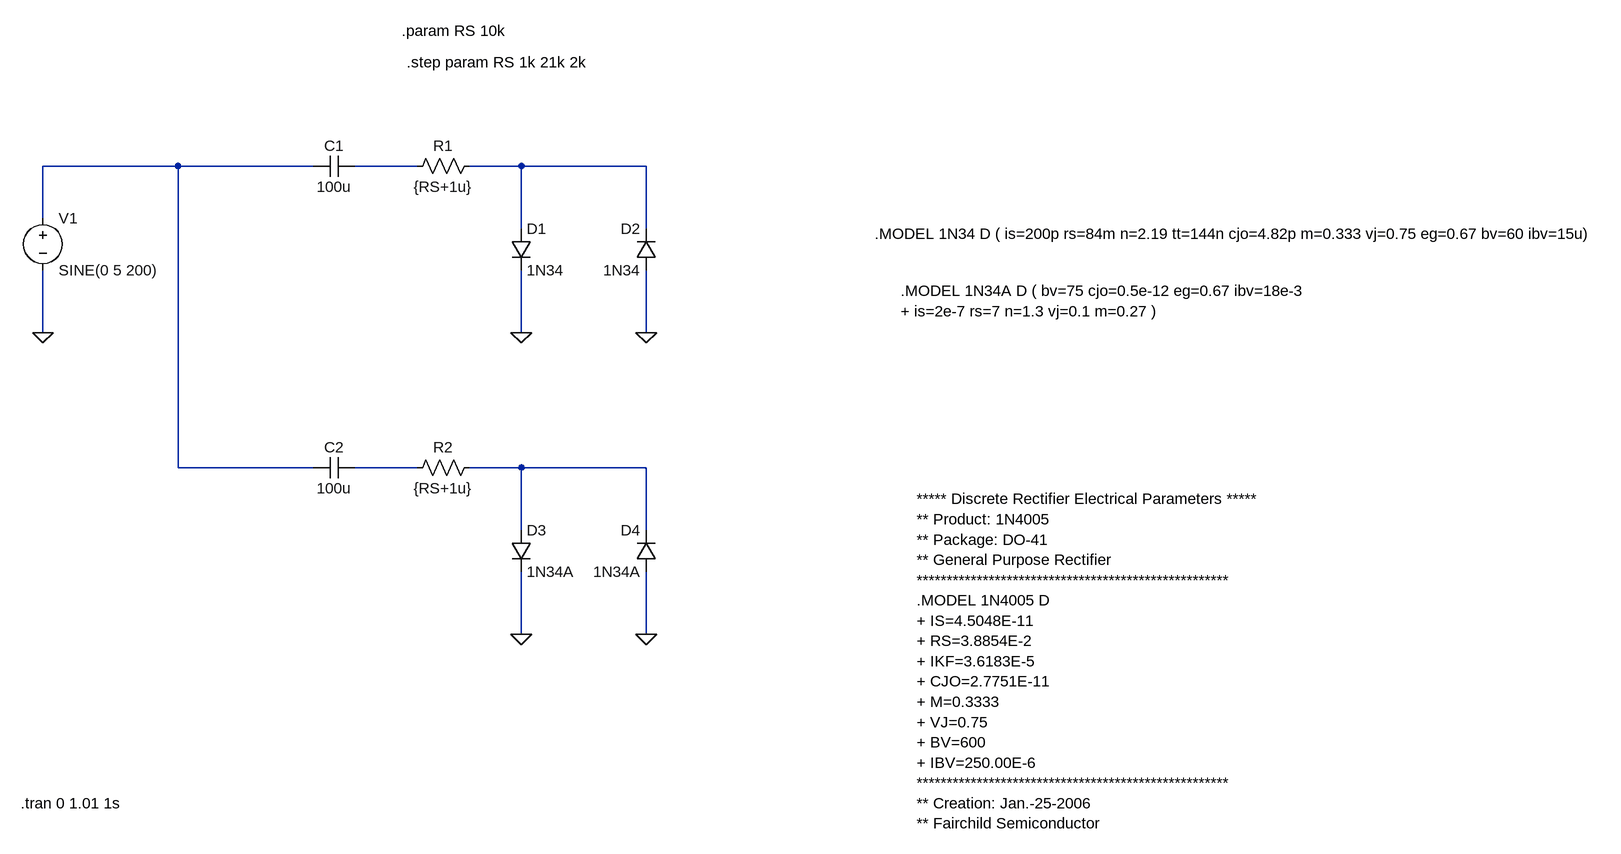
[diagram p0: schematic Diode Clip.asc]
Diode Clip.asc, the LTspice schematic file:
Version 4
SHEET 1 2376 1272
WIRE 16 -16 -192 -16
WIRE 224 -16 16 -16
WIRE 384 -16 288 -16
WIRE 544 -16 464 -16
WIRE 736 -16 544 -16
WIRE -192 64 -192 -16
WIRE 544 80 544 -16
WIRE 736 80 736 -16
WIRE -192 240 -192 144
WIRE 544 240 544 144
WIRE 736 240 736 144
WIRE 16 448 16 -16
WIRE 224 448 16 448
WIRE 384 448 288 448
WIRE 544 448 464 448
WIRE 736 448 544 448
WIRE 544 544 544 448
WIRE 736 544 736 448
WIRE 544 704 544 608
WIRE 736 704 736 608
FLAG -192 240 0
FLAG 736 240 0
FLAG 544 240 0
FLAG 736 704 0
FLAG 544 704 0
SYMBOL voltage -192 48 R0
WINDOW 123 0 0 Left 2
WINDOW 39 0 0 Left 2
SYMATTR InstName V1
SYMATTR Value SINE(0 5 200)
SYMBOL cap 288 -32 R90
WINDOW 0 0 32 VBottom 2
WINDOW 3 32 32 VTop 2
SYMATTR InstName C1
SYMATTR Value 100u
SYMBOL diode 528 80 R0
SYMATTR InstName D1
SYMATTR Value 1N34
SYMBOL diode 752 144 R180
WINDOW 0 24 64 Left 2
WINDOW 3 24 0 Left 2
SYMATTR InstName D2
SYMATTR Value 1N34
SYMBOL res 480 432 R90
WINDOW 0 0 56 VBottom 2
WINDOW 3 32 56 VTop 2
SYMATTR InstName R2
SYMATTR Value {RS+1u}
SYMBOL cap 288 432 R90
WINDOW 0 0 32 VBottom 2
WINDOW 3 32 32 VTop 2
SYMATTR InstName C2
SYMATTR Value 100u
SYMBOL diode 528 544 R0
SYMATTR InstName D3
SYMATTR Value 1N34A
SYMBOL diode 752 608 R180
WINDOW 0 24 64 Left 2
WINDOW 3 24 0 Left 2
SYMATTR InstName D4
SYMATTR Value 1N34A
SYMBOL res 480 -32 R90
WINDOW 0 0 56 VBottom 2
WINDOW 3 32 56 VTop 2
SYMATTR InstName R1
SYMATTR Value {RS+1u}
TEXT 1088 88 Left 2 !.MODEL 1N34 D ( is=200p rs=84m n=2.19 tt=144n cjo=4.82p m=0.333 vj=0.75 eg=0.67 bv=60 ibv=15u)
TEXT 1152 496 Left 2 !***** Discrete Rectifier Electrical Parameters *****\n** Product: 1N4005\n** Package: DO-41\n** General Purpose Rectifier\n****************************************************\n.MODEL 1N4005 D\n+ IS=4.5048E-11\n+ RS=3.8854E-2\n+ IKF=3.6183E-5\n+ CJO=2.7751E-11\n+ M=0.3333\n+ VJ=0.75\n+ BV=600\n+ IBV=250.00E-6\n****************************************************\n** Creation: Jan.-25-2006\n** Fairchild Semiconductor
TEXT -226 964 Left 2 !.tran 0 1.01 1s
TEXT 360 -224 Left 2 !.param RS 10k
TEXT 368 -176 Left 2 !.step param RS 1k 21k 2k
TEXT 1128 176 Left 2 !.MODEL 1N34A D ( bv=75 cjo=0.5e-12 eg=0.67 ibv=18e-3\n+ is=2e-7 rs=7 n=1.3 vj=0.1 m=0.27 )

The netlist it stands for:
* Diode Clip.asc
V1 N001 0 SINE(0 5 200)
C1 N002 N001 100u
D1 N003 0 1N34
D2 0 N003 1N34
R2 N005 N004 {RS+1u}
C2 N004 N001 100u
D3 N005 0 1N34A
D4 0 N005 1N34A
R1 N003 N002 {RS+1u}
.model D D
.lib standard.dio
.MODEL 1N34 D ( is=200p rs=84m n=2.19 tt=144n cjo=4.82p m=0.333 vj=0.75 eg=0.67 bv=60 ibv=15u)
***** Discrete Rectifier Electrical Parameters *****
** Product: 1N4005
** Package: DO-41
** General Purpose Rectifier
****************************************************
.MODEL 1N4005 D
+ IS=4.5048E-11
+ RS=3.8854E-2
+ IKF=3.6183E-5
+ CJO=2.7751E-11
+ M=0.3333
+ VJ=0.75
+ BV=600
+ IBV=250.00E-6
****************************************************
** Creation: Jan.-25-2006
** Fairchild Semiconductor
.tran 0 1.01 1s
.param RS 10k
.step param RS 1k 21k 2k
.MODEL 1N34A D ( bv=75 cjo=0.5e-12 eg=0.67 ibv=18e-3
+ is=2e-7 rs=7 n=1.3 vj=0.1 m=0.27 )
.backanno
.end